# Altium schematic sheet main_3.SchDoc: main
size 282 x 200 mm; Date: 9/25/2019 7:26:09 PM; SheetNumber: 4; CNAME: RJ Cunningham; GateName_1: G$1; SymbolName_1: A4L-LOC; LibraryName: frames; DeviceSetName: A4L-LOC
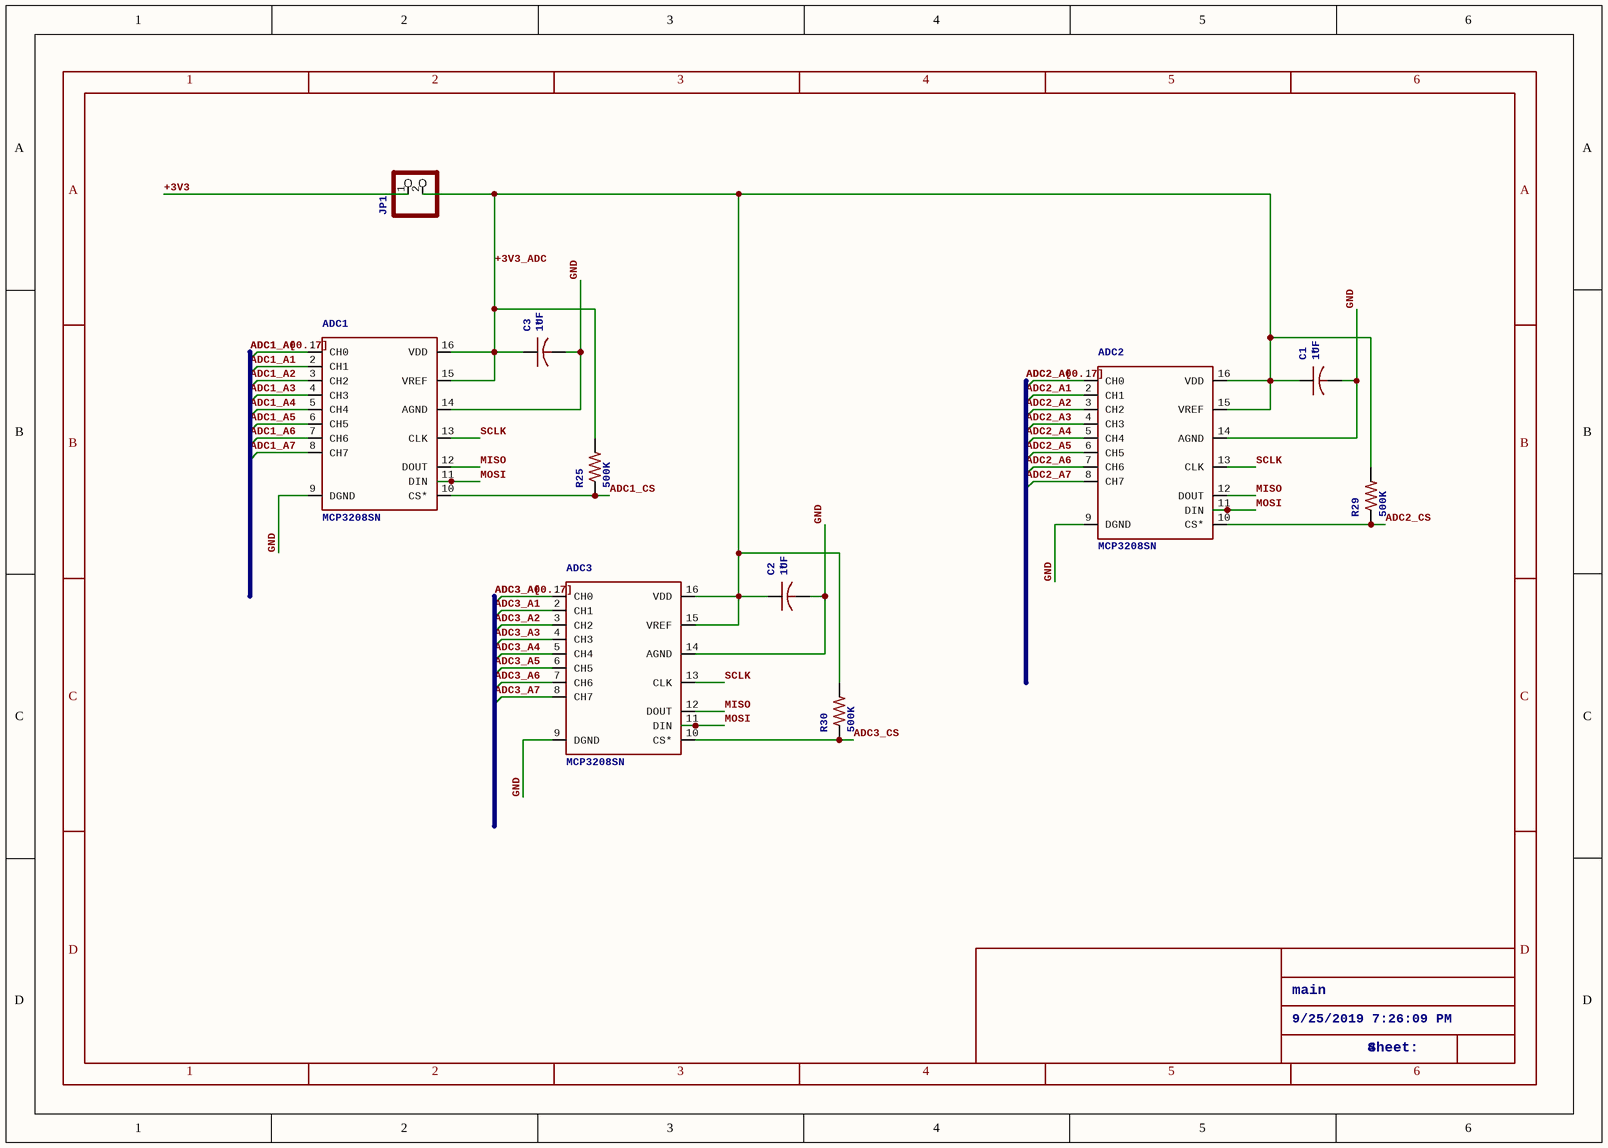
[diagram p0: main_3.SchDoc]

## Parts
ADC1  MCP3208SN  [SO-16]
ADC2  MCP3208SN  [SO-16]
ADC3  MCP3208SN  [SO-16]
C1  1UF  [C0805]
C2  1UF  [C0805]
C3  1UF  [C0805]
JP1  PINHD-1X2  [1X02]  (value not drawn)
R25  500K  [R0805]
R29  500K  [R0805]
R30  500K  [R0805]

## Nets
+3V3: JP1.1
+3V3_ADC: ADC1.15(VREF) ADC1.16(VDD) ADC2.15(VREF) ADC2.16(VDD) ADC3.15(VREF) ADC3.16(VDD) C1.1 C2.1 C3.1 JP1.2 R25.2 R29.2 R30.2
ADC1_CS: ADC1.10(CS*) R25.1
ADC2_CS: ADC2.10(CS*) R29.1
ADC3_CS: ADC3.10(CS*) R30.1
GND: ADC1.9(DGND) ADC1.14(AGND) ADC2.9(DGND) ADC2.14(AGND) ADC3.9(DGND) ADC3.14(AGND) C1.2 C2.2 C3.2
MISO: ADC1.12(DOUT) ADC2.12(DOUT) ADC3.12(DOUT)
MOSI: ADC1.11(DIN) ADC2.11(DIN) ADC3.11(DIN)
SCLK: ADC1.13(CLK) ADC2.13(CLK) ADC3.13(CLK)

Not connected (* = marked no-connect by the designer): ADC1 1(CH0) 2(CH1) 3(CH2) 4(CH3) 5(CH4) 6(CH5) 7(CH6) 8(CH7); ADC2 1(CH0) 2(CH1) 3(CH2) 4(CH3) 5(CH4) 6(CH5) 7(CH6) 8(CH7); ADC3 1(CH0) 2(CH1) 3(CH2) 4(CH3) 5(CH4) 6(CH5) 7(CH6) 8(CH7)

## Buses and harness runs
bus ADC1_A0 = ADC1_A1 = ADC1_A2 = ADC1_A3 = ADC1_A4 = ADC1_A5 = ADC1_A6 = ADC1_A7 = ADC1_A[0..7]
bus ADC2_A0 = ADC2_A1 = ADC2_A2 = ADC2_A3 = ADC2_A4 = ADC2_A5 = ADC2_A6 = ADC2_A7 = ADC2_A[0..7]
bus ADC3_A0 = ADC3_A1 = ADC3_A2 = ADC3_A3 = ADC3_A4 = ADC3_A5 = ADC3_A6 = ADC3_A7 = ADC3_A[0..7]

## Notes on the sheet
- main
- 9/25/2019 7:26:09 PM
- 4
- Sheet:
- 1
- 2
- 3
- 5
- 6
- A
- B
- C
- D

## Library data of the parts
ADC1-ADC3 = MCP3208SN: 2.7V Dual Channel 12-Bit A/D Converter with SPI Serial InterfaceSource: http://ww1.microchip.com/downloads/en/DeviceDoc/21034D.pdf; MPN: MCP3202-CI/SN; GateName_1: P; DeviceName: SN; SymbolName_1: MCP3208; LibraryName: microchip-extra; DeviceSetName: MCP3208; MF: MICROCHIP; OC_FARNELL: 1196803; OC_NEWARK: 19C7207
C1-C3 = C-USC0805: CAPACITOR, American symbol; GateName_1: G$1; SymbolName_1: C-US; DeviceName: C0805; LibraryName: rcl; DeviceSetName: C-US; NAME: *; SPICEPREFIX: C
JP1 = PINHD-1X2: PIN HEADER; GateName_1: G$1; SymbolName_1: PINHD2; LibraryName: pinhead; DeviceSetName: PINHD-1X2
R25 R29 R30 = R-US_R0805: RESISTOR, American symbol; GateName_1: G$1; SymbolName_1: R-US; DeviceSetName: R-US_; DeviceName: R0805; LibraryName: rcl